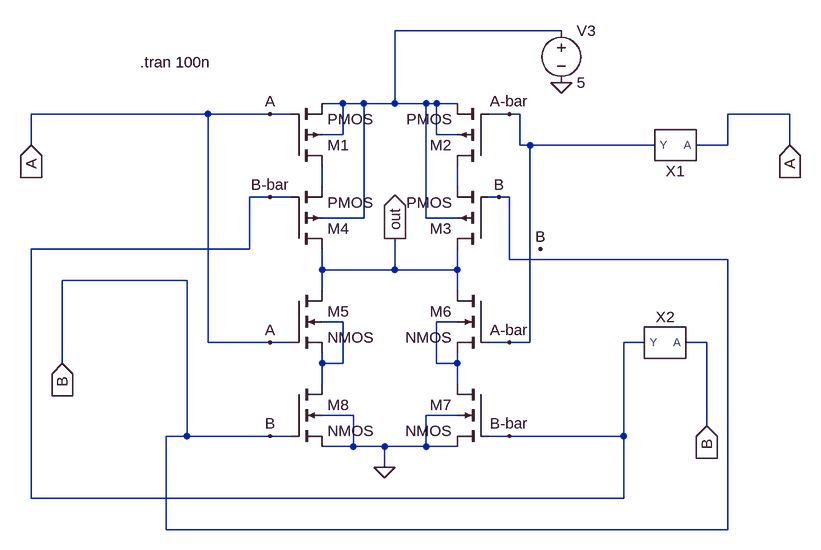
[diagram p0: schematic CMOS_xor.asc]
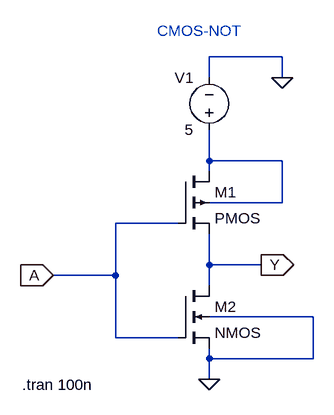
[diagram p1: sub-circuit cmos_not.asc]
CMOS_xor.asc, the LTspice schematic file:
Version 4
SHEET 1 2056 3096
WIRE 512 -96 256 -96
WIRE 176 16 144 16
WIRE 208 16 176 16
WIRE 256 16 256 -96
WIRE 256 16 208 16
WIRE 304 16 256 16
WIRE 320 16 304 16
WIRE 352 16 320 16
WIRE -32 32 -304 32
WIRE 64 32 -32 32
WIRE 96 32 64 32
WIRE 432 32 400 32
WIRE 448 32 432 32
WIRE 864 32 768 32
WIRE 176 64 176 16
WIRE 176 64 144 64
WIRE 320 64 320 16
WIRE 352 64 320 64
WIRE -304 80 -304 32
WIRE 448 80 448 32
WIRE 464 80 448 80
WIRE 656 80 464 80
WIRE 768 80 768 32
WIRE 768 80 720 80
WIRE 864 80 864 32
WIRE 144 144 144 112
WIRE 352 144 352 112
WIRE 64 160 32 160
WIRE 96 160 64 160
WIRE 416 160 400 160
WIRE 432 160 416 160
WIRE 208 192 208 16
WIRE 208 192 144 192
WIRE 304 192 304 16
WIRE 352 192 304 192
WIRE 32 240 32 160
WIRE 32 240 -304 240
WIRE 432 256 432 160
WIRE 768 256 432 256
WIRE 144 272 144 240
WIRE 256 272 256 224
WIRE 256 272 144 272
WIRE 352 272 352 240
WIRE 352 272 256 272
WIRE -64 288 -256 288
WIRE 144 304 144 272
WIRE 352 304 352 272
WIRE 176 352 144 352
WIRE 352 352 320 352
WIRE -32 384 -32 32
WIRE 64 384 -32 384
WIRE 96 384 64 384
WIRE 432 384 400 384
WIRE 464 384 464 80
WIRE 464 384 432 384
WIRE 640 384 608 384
WIRE 736 384 704 384
WIRE -256 416 -256 288
WIRE 144 416 144 400
WIRE 176 416 176 352
WIRE 176 416 144 416
WIRE 320 416 320 352
WIRE 352 416 352 400
WIRE 352 416 320 416
WIRE 144 448 144 416
WIRE 352 448 352 416
WIRE 192 496 144 496
WIRE 352 496 304 496
WIRE 736 512 736 384
WIRE -64 528 -64 288
WIRE -64 528 -96 528
WIRE 64 528 -64 528
WIRE 96 528 64 528
WIRE 432 528 400 528
WIRE 608 528 608 384
WIRE 608 528 432 528
WIRE 192 544 192 496
WIRE 192 544 144 544
WIRE 240 544 192 544
WIRE 304 544 304 496
WIRE 304 544 240 544
WIRE 352 544 304 544
WIRE 240 576 240 544
WIRE -304 624 -304 240
WIRE 608 624 608 528
WIRE 608 624 -304 624
WIRE -96 672 -96 528
WIRE 768 672 768 256
WIRE 768 672 -96 672
FLAG 240 576 0
FLAG 64 32 A
FLAG 64 384 A
FLAG 64 528 B
FLAG 480 240 B
FLAG 416 160 B
FLAG 432 32 A-bar
FLAG 432 384 A-bar
FLAG 432 528 B-bar
FLAG 64 160 B-bar
FLAG 256 224 out
IOPIN 256 224 Out
FLAG -304 80 A
IOPIN -304 80 In
FLAG -256 416 B
IOPIN -256 416 In
FLAG 512 -16 0
FLAG 864 80 A
IOPIN 864 80 In
FLAG 736 512 B
IOPIN 736 512 In
SYMBOL pmos4 96 112 M180
SYMATTR InstName M1
SYMATTR Value2 l=180n w=720n
SYMBOL pmos4 400 112 R180
SYMATTR InstName M2
SYMATTR Value2 l=180n w=720n
SYMBOL pmos4 400 240 R180
SYMATTR InstName M3
SYMATTR Value2 l=180n w=720n
SYMBOL pmos4 96 240 M180
SYMATTR InstName M4
SYMATTR Value2 l=180n w=720n
SYMBOL nmos4 96 304 R0
SYMATTR InstName M5
SYMATTR Value2 l=180n w=360n
SYMBOL nmos4 400 304 M0
SYMATTR InstName M6
SYMATTR Value2 l=180n w=360n
SYMBOL nmos4 400 448 M0
SYMATTR InstName M7
SYMATTR Value2 l=180n w=360n
SYMBOL nmos4 96 448 R0
SYMATTR InstName M8
SYMATTR Value2 l=180n w=360n
SYMBOL CMOS_not 688 80 R180
SYMATTR InstName X1
SYMBOL CMOS_not 672 384 M0
SYMATTR InstName X2
SYMBOL voltage 512 -112 R0
WINDOW 123 0 0 Left 0
WINDOW 39 0 0 Left 0
SYMATTR InstName V3
SYMATTR Value 5
TEXT -136 -48 Left 2 !.tran 100n

cmos_not.asc, the sub-circuit schematic file:
Version 4
SHEET 1 880 680
WIRE 320 16 208 16
WIRE 208 48 208 16
WIRE 320 48 320 16
WIRE 208 176 208 128
WIRE 320 176 208 176
WIRE 208 192 208 176
WIRE 320 240 320 176
WIRE 320 240 208 240
WIRE 160 272 64 272
WIRE 208 336 208 288
WIRE 288 336 208 336
WIRE 64 352 64 272
WIRE 64 352 -32 352
WIRE 208 368 208 336
WIRE 368 416 208 416
WIRE 64 448 64 352
WIRE 160 448 64 448
WIRE 208 480 208 464
WIRE 368 480 368 416
WIRE 368 480 208 480
WIRE 208 512 208 480
FLAG 208 512 0
FLAG 288 336 Y
IOPIN 288 336 Out
FLAG 320 48 0
FLAG -32 352 A
IOPIN -32 352 In
SYMBOL pmos4 160 192 R0
SYMATTR InstName M1
SYMBOL nmos4 160 368 R0
SYMATTR InstName M2
SYMBOL voltage 208 144 R180
WINDOW 0 24 96 Left 2
WINDOW 3 24 16 Left 2
WINDOW 123 0 0 Left 0
WINDOW 39 0 0 Left 0
SYMATTR InstName V1
SYMATTR Value 5
TEXT 128 -24 Left 2 ;CMOS-NOT
TEXT -80 520 Left 2 !.tran 100n

The netlist it stands for:
* CMOS_xor.asc
M1 N002 A N001 N001 PMOS l=180n w=720n
M2 N003 A-bar N001 N001 PMOS l=180n w=720n
M3 out B N003 N001 PMOS l=180n w=720n
M4 out B-bar N002 N001 PMOS l=180n w=720n
M5 out A N004 N004 NMOS l=180n w=360n
M6 out A-bar N005 N005 NMOS l=180n w=360n
M7 N005 B-bar 0 0 NMOS l=180n w=360n
M8 N004 B 0 0 NMOS l=180n w=360n
XX1 A A-bar cmos_not
XX2 B B-bar cmos_not
V3 N001 0 5

* block symbol definitions
.subckt cmos_not A Y
M1 N001 A Y N001 PMOS
M2 Y A 0 0 NMOS
V1 N001 0 5
* CMOS-NOT
.tran 100n
.ends cmos_not

.model NMOS NMOS
.model PMOS PMOS
.lib standard.mos
.tran 100n
.backanno
.end